# EAGLE design jarvis-2.0 (EAGLE 6.6.0)
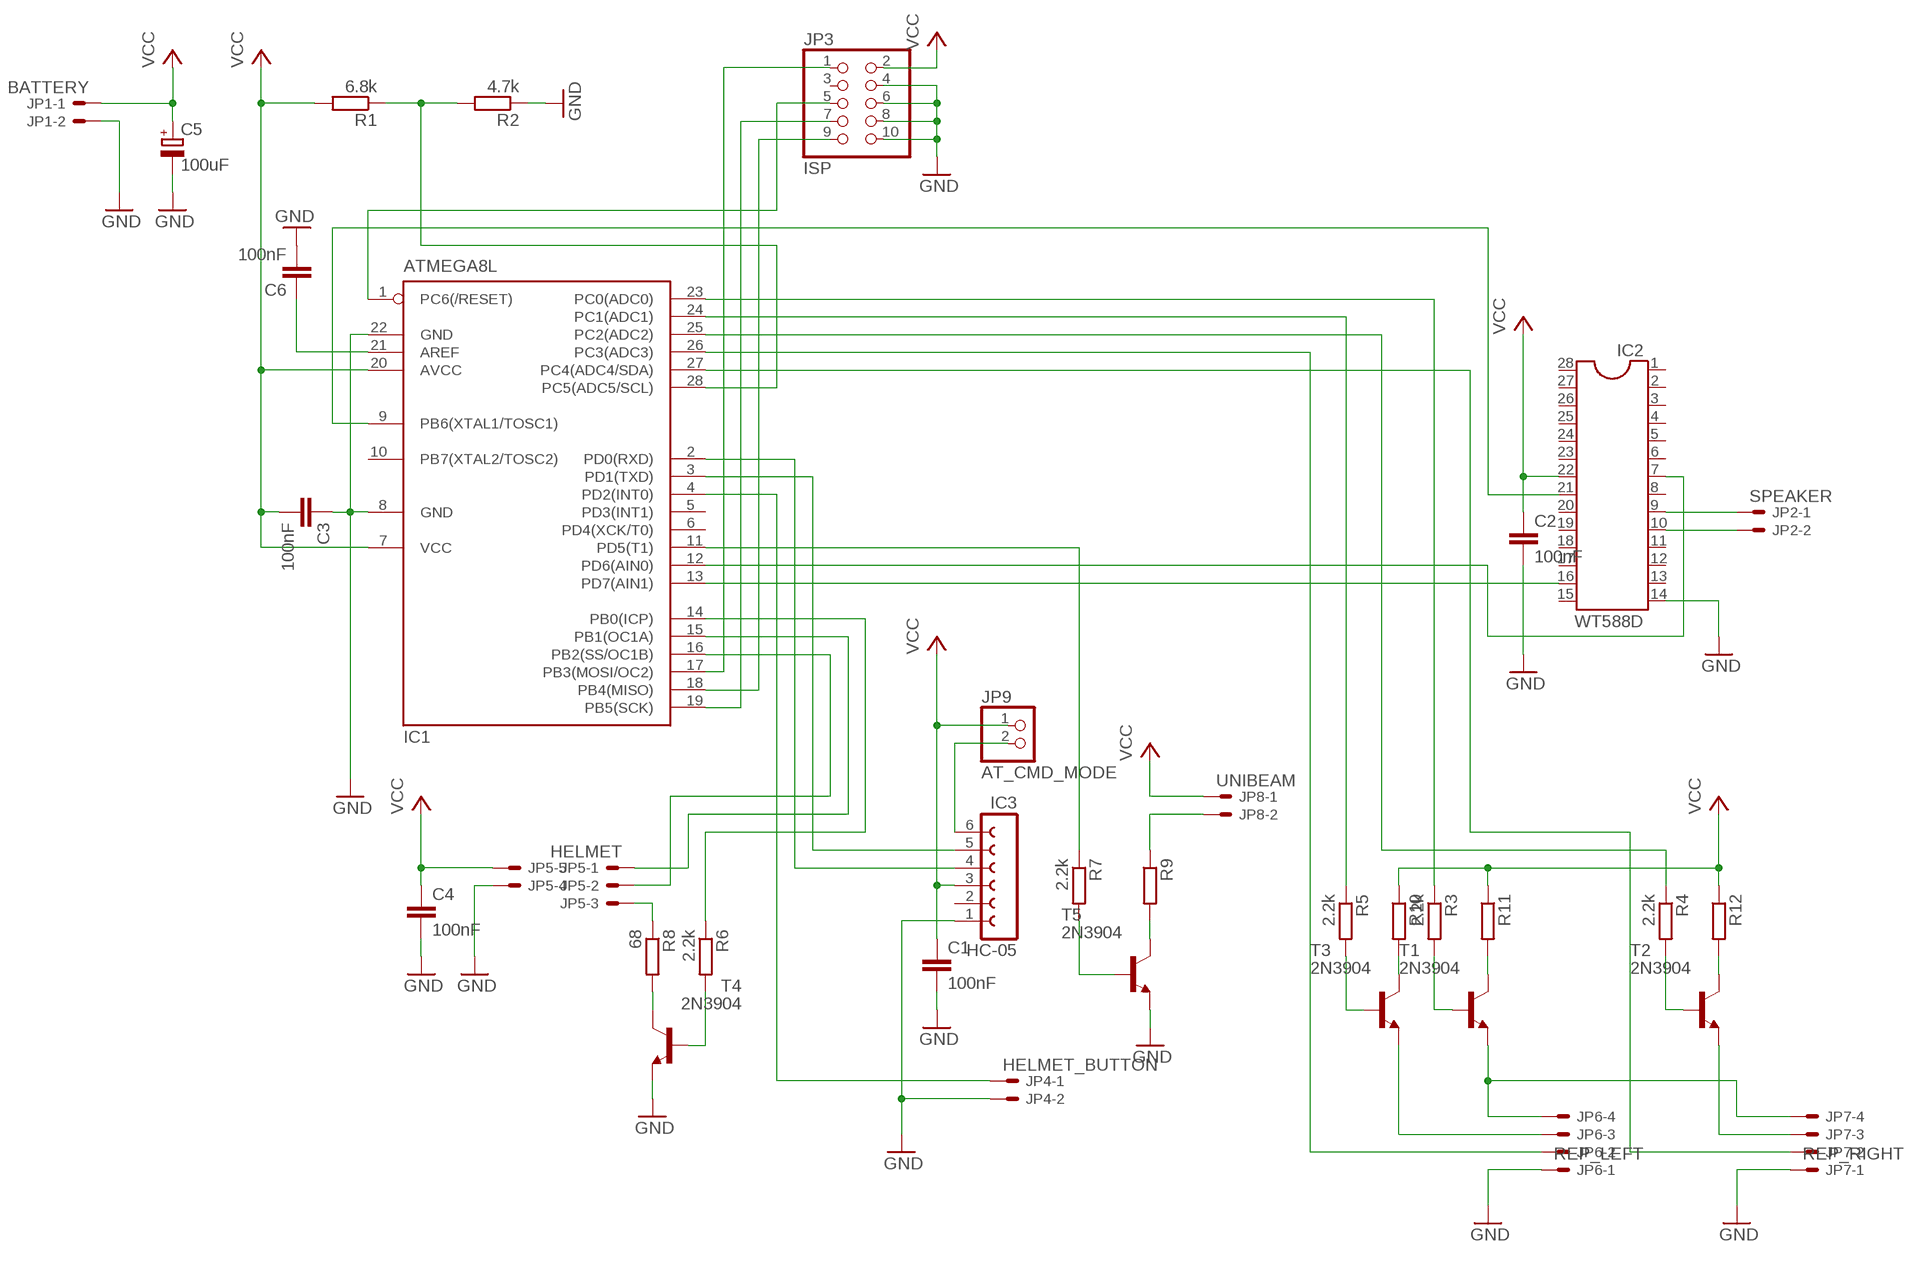
[diagram p0: schematic, sheet 1]

## Parts
C1  100nF  C2.5/2  [C2.5-2]
C2  100nF  C2.5/2  [C2.5-2]
C3  100nF  C2.5/2  [C2.5-2]
C4  100nF  C2.5/2  [C2.5-2]
C5  100uF  CPOL-EUE5-5  [E5-5]
C6  100nF  C2.5/2  [C2.5-2]
IC1  ATMEGA8L  MEGA8-P  [DIL28-3]
IC2  WT588D  DIL28  [DIL28-6]
IC3  HC-05  FE06-1  [FE06]
JP1  BATTERY  22-23-2021  [22-23-2021]
JP2  SPEAKER  22-23-2021  [22-23-2021]
JP3  ISP  PINHD-2X5  [2X05]
JP4  HELMET_BUTTON  22-23-2021  [22-23-2021]
JP5  HELMET  22-23-2051  [22-23-2051]
JP6  REP_LEFT  22-23-2041  [22-23-2041]
JP7  REP_RIGHT  22-23-2041  [22-23-2041]
JP8  UNIBEAM  22-23-2021  [22-23-2021]
JP9  AT_CMD_MODE  PINHD-1X2  [1X02]
R1  6.8k  R-EU_0204/7  [0204/7]
R2  4.7k  R-EU_0204/7  [0204/7]
R3  2.2k  R-EU_0204/7  [0204/7]
R4  2.2k  R-EU_0204/7  [0204/7]
R5  2.2k  R-EU_0204/7  [0204/7]
R6  2.2k  R-EU_0204/7  [0204/7]
R7  2.2k  R-EU_0204/7  [0204/7]
R8  68  R-EU_0204/7  [0204/7]
R9  R-EU_0204/7  [0204/7]
R10  R-EU_0204/7  [0204/7]
R11  R-EU_0204/7  [0204/7]
R12  R-EU_0204/7  [0204/7]
T1  2N3904  BC546-NPN-TO92-CBE  [TO92-CBE]
T2  2N3904  BC546-NPN-TO92-CBE  [TO92-CBE]
T3  2N3904  BC546-NPN-TO92-CBE  [TO92-CBE]
T4  2N3904  BC546-NPN-TO92-CBE  [TO92-CBE]
T5  2N3904  BC546-NPN-TO92-CBE  [TO92-CBE]

## Nets
B$1: IC1.14(PB0(ICP)) R6.1
GND: C1.2 C2.2 C3.1 C4.2 C5.- C6.2 IC1.8(GND) IC1.22(GND) IC2.14 IC3.1 JP1.2 JP3.4 JP3.6 JP3.8 JP3.10 JP4.2 JP5.4 JP6.1 JP7.1 R2.1 T4.E T5.E
N$1: IC1.3(PD1(TXD)) IC3.5
N$2: IC1.2(PD0(RXD)) IC3.4
N$3: IC1.4(PD2(INT0)) JP4.1
N$4: IC1.28(PC5(ADC5/SCL)) R1.1 R2.2
N$5: IC2.9 JP2.1
N$6: IC2.10 JP2.2
N$7: IC1.13(PD7(AIN1)) IC2.16
N$8: IC1.9(PB6(XTAL1/TOSC1)) IC2.21
N$9: IC1.17(PB3(MOSI/OC2)) JP3.1
N$10: IC1.18(PB4(MISO)) JP3.9
N$11: IC1.19(PB5(SCK)) JP3.7
N$12: IC1.16(PB2(SS/OC1B)) JP5.2
N$13: IC1.15(PB1(OC1A)) JP5.1
N$14: IC1.11(PD5(T1)) R7.1
N$15: IC1.23(PC0(ADC0)) R3.1
N$16: R6.2 T4.B
N$17: JP8.2 R9.1
N$18: R3.2 T1.B
N$19: R7.2 T5.B
N$20: R4.2 T2.B
N$21: IC1.12(PD6(AIN0)) IC2.7
N$22: IC1.24(PC1(ADC1)) R5.1
N$23: R5.2 T3.B
N$24: IC1.25(PC2(ADC2)) R4.1
N$25: JP6.4 JP7.4 T1.E
N$26: JP6.3 T3.E
N$27: JP7.3 T2.E
N$28: IC1.26(PC3(ADC3)) JP6.2
N$29: IC1.27(PC4(ADC4/SDA)) JP7.2
N$30: JP5.3 R8.1
N$31: R8.2 T4.C
N$32: R9.2 T5.C
N$33: R12.2 T2.C
N$34: R11.2 T1.C
N$35: R10.2 T3.C
N$37: C6.1 IC1.21(AREF)
N$38: IC3.6 JP9.2
N$40: IC1.1(PC6(/RESET)) JP3.5
VCC: C1.1 C2.1 C3.2 C4.1 C5.+ IC1.7(VCC) IC1.20(AVCC) IC2.22 IC3.3 JP1.1 JP3.2 JP5.5 JP8.1 JP9.1 R1.2 R10.1 R11.1 R12.1
Unconnected: IC1.5(PD3(INT1)) IC1.6(PD4(XCK/T0)) IC1.10(PB7(XTAL2/TOSC2)) IC2.1 IC2.2 IC2.3 IC2.4 IC2.5 IC2.6 IC2.8 IC2.11 IC2.12 IC2.13 IC2.15 IC2.17 IC2.18 IC2.19 IC2.20 IC2.23 IC2.24 IC2.25 IC2.26 IC2.27 IC2.28 IC3.2 JP3.3

## Library data of the parts
C1-C4 C6 = capacitor-wima:C: CAPACITOR naming: grid - package width
C5 = rcl:CPOL-EU: POLARIZED CAPACITOR, European symbol
IC1 = atmel:MEGA8-P: MICROCONTROLLER 8 Kbytes FLASH, 1 kbytes SRAM, 512 bytes EEPROM, USART, 4-channel 10 bit ADC, 2-channel 8 bit ADC Pin compatible with Atmega48, ATMega88, ATMega168 Source: avr.lbr; OC_FARNELL: unknown; OC_NEWARK: unknown
IC2 = ic-package:DIL28: Dual In Line
IC3 = con-lsta:FE06-1: FEMALE HEADER; OC_FARNELL: unknown; OC_NEWARK: unknown
JP1 JP2 JP4 JP8 = con-molex:22-23-2021: .100" (2.54mm) Center Header - 2 Pin; MF: MOLEX; MPN: 22-23-2021; OC_FARNELL: 1462926; OC_NEWARK: 25C3832
JP3 = pinhead:PINHD-2X5: PIN HEADER
JP5 = con-molex:22-23-2051: .100" (2.54mm) Center Header - 5 Pin; MF: MOLEX; MPN: 22-23-2051; OC_FARNELL: 1462952; OC_NEWARK: 38C9178
JP6 JP7 = con-molex:22-23-2041: .100" (2.54mm) Center Header - 4 Pin; MF: MOLEX; MPN: 22-23-2041; OC_FARNELL: 1462920; OC_NEWARK: 38C0355
JP9 = pinhead:PINHD-1X2: PIN HEADER
R1-R12 = resistor:R-EU_: RESISTOR, European symbol
T1-T5 = transistor:*-NPN-: NPN Transistror BF959 corrected 2008.03.06

## Board
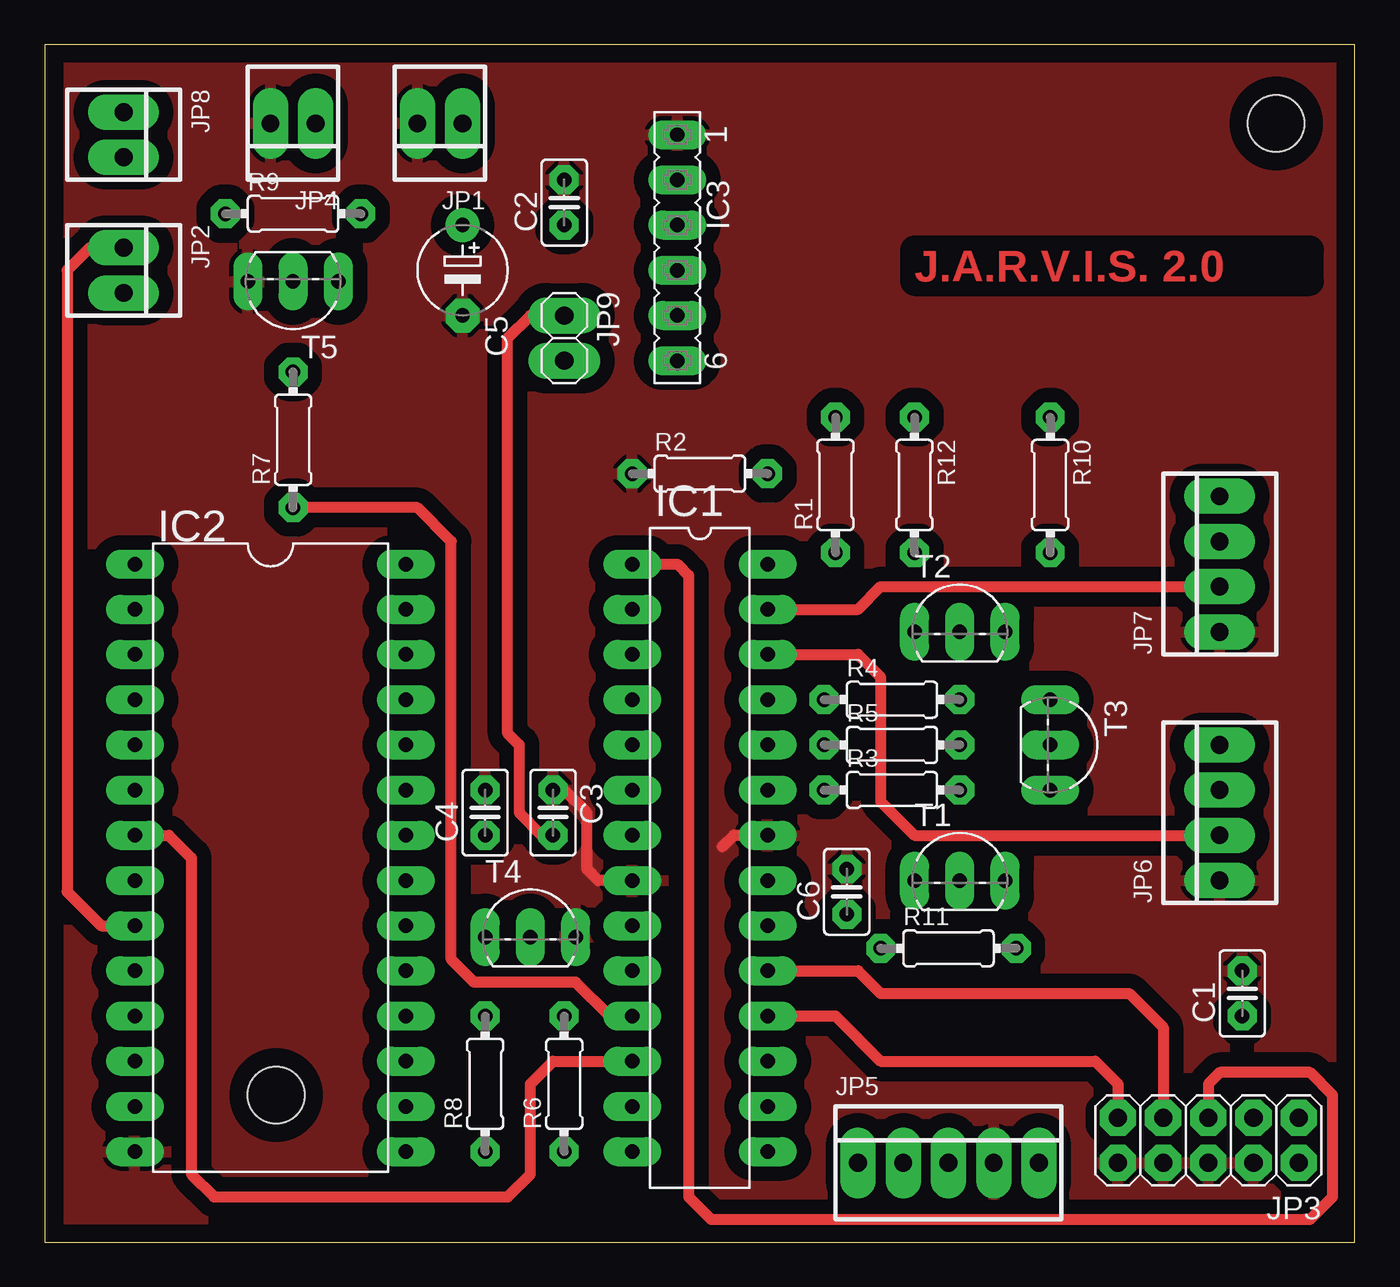
[diagram p1: board, top side]
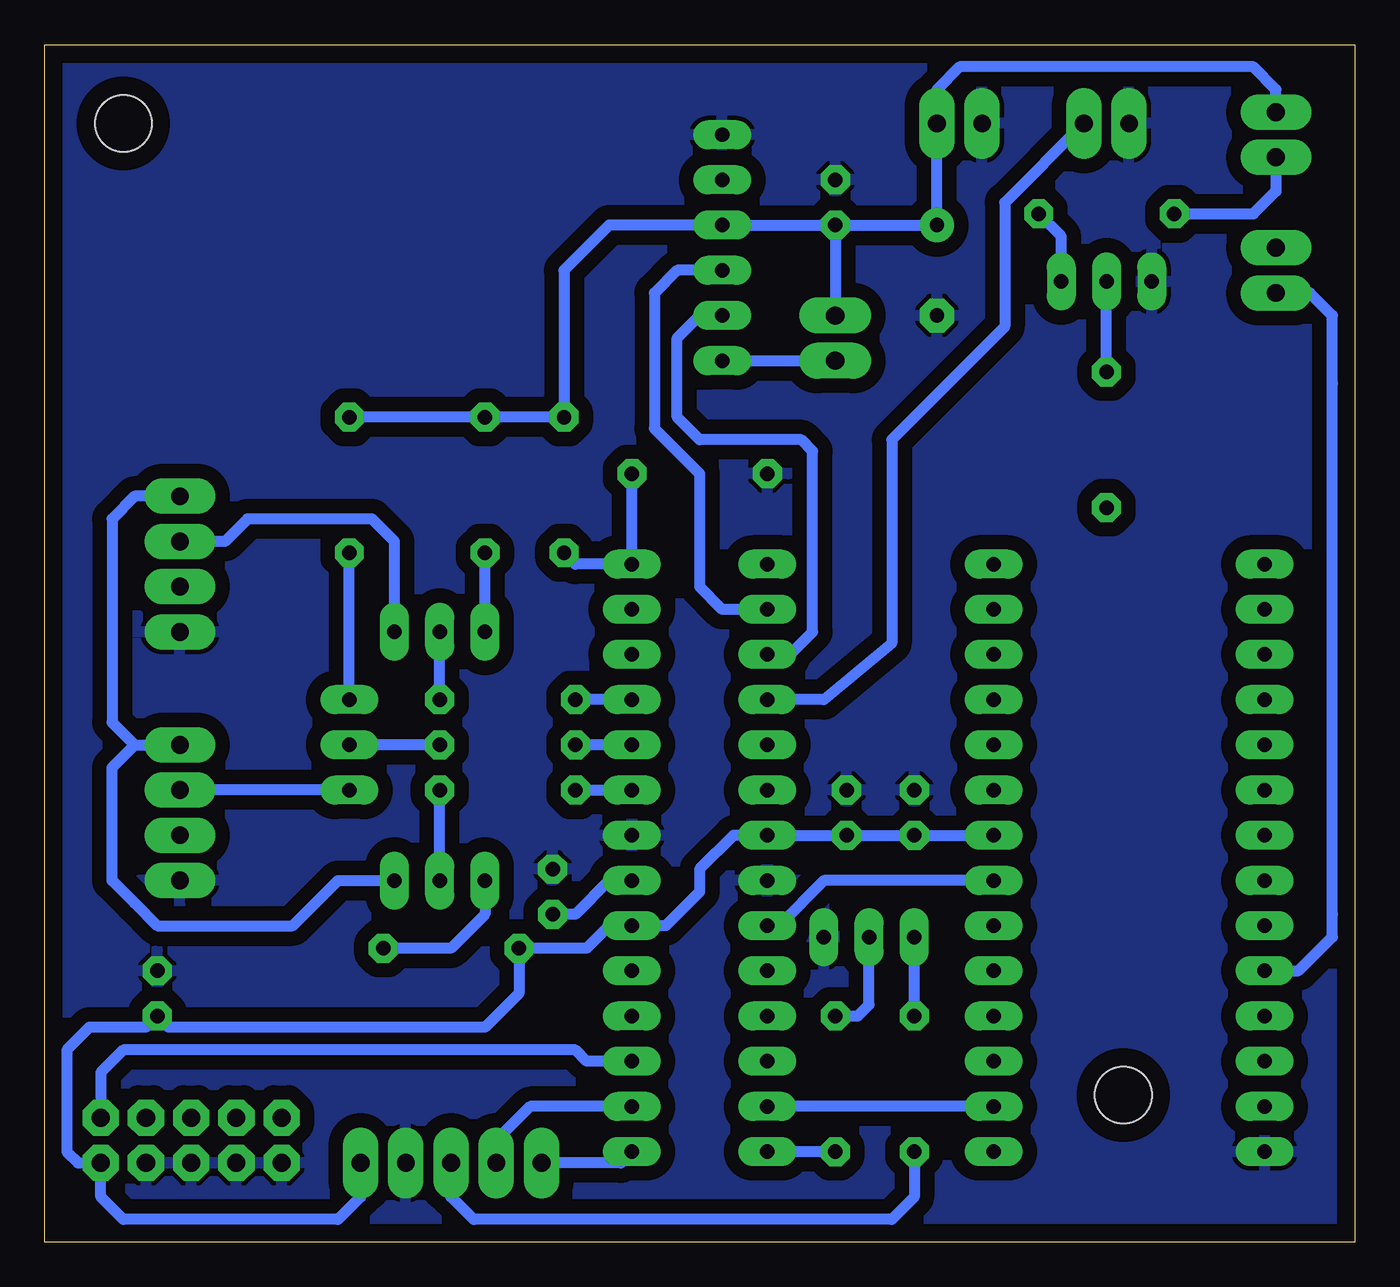
[diagram p2: board, bottom side, seen from below]

Size 73.65 x 67.3 mm. Coordinates in mm from the lower left corner, seen from the top.
Outline: 0,0 73.65,0 73.65,67.3 0,67.3 0,0
Copper layers (1*16): Top 0.035mm / dielectric 1.5mm / Bottom 0.035mm
Design rules "default *": minimum track width 10mil, minimum drill 24mil, track to track 8mil, track to pad 8mil, pad to pad 8mil, via to via 8mil, smd to smd 8mil, copper to edge 40mil, drill to drill 8mil, minimum pad ring 10mil, minimum via ring 8mil, stop-mask expansion 4mil, vias tented up to drill 0mil, thermal gap 10mil
Holes 3.2 mm at 69.22,62.87 13.02,8.26

### Footprints (pad centres in the part's own frame; a part is rotated, then mirrored left to right if it is on the bottom)
C2.5-2 = drill 0.813 pad 1.6 octagon: 1 -1.27,0; 2 1.27,0
E5-5 = drill 0.813 pad 1.905: + -2.54,0 | drill 0.813 pad 1.905 octagon: - 2.54,0
DIL28-3 = drill 0.813 long: 1 -16.51,-3.81; 2 -13.97,-3.81; 3 -11.43,-3.81; 4 -8.89,-3.81; 5 -6.35,-3.81; 6 -3.81,-3.81; 7 -1.27,-3.81; 8 1.27,-3.81; 9 3.81,-3.81; 10 6.35,-3.81; 11 8.89,-3.81; 12 11.43,-3.81; 13 13.97,-3.81; 14 16.51,-3.81; 15 16.51,3.81; 16 13.97,3.81; 17 11.43,3.81; 18 8.89,3.81; 19 6.35,3.81; 20 3.81,3.81; 21 1.27,3.81; 22 -1.27,3.81; 23 -3.81,3.81; 24 -6.35,3.81; 25 -8.89,3.81; 26 -11.43,3.81; 27 -13.97,3.81; 28 -16.51,3.81
DIL28-6 = drill 0.813 long: 1 -16.51,-7.62; 2 -13.97,-7.62; 3 -11.43,-7.62; 4 -8.89,-7.62; 5 -6.35,-7.62; 6 -3.81,-7.62; 7 -1.27,-7.62; 8 1.27,-7.62; 9 3.81,-7.62; 10 6.35,-7.62; 11 8.89,-7.62; 12 11.43,-7.62; 13 13.97,-7.62; 14 16.51,-7.62; 15 16.51,7.62; 16 13.97,7.62; 17 11.43,7.62; 18 8.89,7.62; 19 6.35,7.62; 20 3.81,7.62; 21 1.27,7.62; 22 -1.27,7.62; 23 -3.81,7.62; 24 -6.35,7.62; 25 -8.89,7.62; 26 -11.43,7.62; 27 -13.97,7.62; 28 -16.51,7.62
FE06 = drill 0.813 long: 1 -6.35,0; 2 -3.81,0; 3 -1.27,0; 4 1.27,0; 5 3.81,0; 6 6.35,0
22-23-2021 = drill 1 long: 1 -1.27,0; 2 1.27,0
2X05 = drill 1.016 octagon: 1 -5.08,-1.27; 2 -5.08,1.27; 3 -2.54,-1.27; 4 -2.54,1.27; 5 0,-1.27; 6 0,1.27; 7 2.54,-1.27; 8 2.54,1.27; 9 5.08,-1.27; 10 5.08,1.27
22-23-2051 = drill 1 long: 1 -5.08,0; 2 -2.54,0; 3 0,0; 4 2.54,0; 5 5.08,0
22-23-2041 = drill 1 long: 1 -3.81,0; 2 -1.27,0; 3 1.27,0; 4 3.81,0
1X02 = drill 1.016 long: 1 -1.27,0; 2 1.27,0
0204/7 = drill 0.813 octagon: 1 -3.81,0; 2 3.81,0
TO92-CBE = drill 0.813 long: B 0,0; C -2.54,0; E 2.54,0

### Placement (x,y rotation side)
C1  67.31,13.97 90 top
C2  29.21,58.42 90 top
C3  28.57,24.13 270 top
C4  24.77,24.13 90 top
C5  23.5,54.61 270 top
C6  45.09,19.68 90 top
IC1  36.83,21.59 270 top
IC2  12.7,21.59 270 top
IC3  35.56,55.88 270 top
JP1  22.23,62.87 180 top
JP2  4.45,54.61 270 top
JP3  65.41,5.71 180 top
JP4  13.97,62.87 180 top
JP5  50.8,4.45 0 top
JP6  66.04,24.13 90 top
JP7  66.04,38.1 90 top
JP8  4.45,62.23 270 top
JP9  29.21,50.8 270 top
R1  44.45,42.55 90 top
R2  36.83,43.18 0 top
R3  47.62,25.4 0 top
R4  47.62,30.48 0 top
R5  47.62,27.94 0 top
R6  29.21,8.89 90 top
R7  13.97,45.09 90 top
R8  24.77,8.89 90 top
R9  13.97,57.78 0 top
R10  56.52,42.55 270 top
R11  50.8,16.51 0 top
R12  48.9,42.55 270 top
T1  51.44,20.32 0 top
T2  51.44,34.29 0 top
T3  56.52,27.94 270 top
T4  27.3,17.14 0 top
T5  13.97,53.98 180 top

### Tracks (layer width: path | path; a pad name or v marks a point on that pad's centre or on a via)
B$1
  Bottom 0.61: R6.1 IC1.14
GND
  Top 0.61: IC1.8 31.11,20.32 30.48,20.95 30.48,24.13 29.21,25.4 C3.1 | IC1.22 38.73,22.86 38.1,22.23
  pour Bottom (isolate 0.813): 1.27,66.67 73.03,66.67 73.03,0.64 1.27,0.64
  pour Top (isolate 0.813): 1.27,66.67 73.03,66.67 73.03,0.64 1.27,0.64
N$1
  Bottom 0.61: IC1.3 31.75,33.02 30.48,34.29 30.48,44.45 31.11,45.09 36.83,45.09 38.1,46.35 38.1,50.8 36.83,52.07 IC3.5
N$2
  Bottom 0.61: IC1.2 35.56,35.56 36.83,36.83 36.83,43.18 39.37,45.72 39.37,53.34 38.1,54.61 IC3.4
N$3
  Bottom 0.61: IC1.4 29.84,30.48 26.04,33.66 26.04,45.09 23.5,47.62 19.68,51.44 19.68,58.42 JP4.1
N$4
  Bottom 0.61: R2.2 IC1.28 43.81,38.1 R1.1
N$5
  Top 0.61: JP2.1 2.54,55.88 1.27,54.61 1.27,19.68 3.17,17.78 IC2.9
N$6
  Bottom 0.61: IC2.10 3.17,15.24 1.27,17.14 1.27,18.41 1.27,48.26 1.27,52.07 2.54,53.34 JP2.2
N$7
  Bottom 0.61: IC2.16 IC1.13
N$8
  Bottom 0.61: IC2.21 29.84,20.32 32.38,17.78 IC1.9
N$9
  Bottom 0.61: IC1.17 43.18,10.16 43.81,10.79 69.22,10.79 70.48,9.53 JP3.1
N$10
  Top 0.61: IC1.18 44.45,12.7 46.99,10.16 59.05,10.16 60.33,8.89 JP3.9
N$11
  Top 0.61: IC1.19 45.72,15.24 46.99,13.97 60.96,13.97 62.87,12.06 JP3.7
N$12
  Bottom 0.61: IC1.16 46.35,7.62 48.26,5.71 JP5.2
N$13
  Bottom 0.61: IC1.15 41.27,4.45 JP5.1
N$14
  Top 0.61: IC1.11 31.75,12.7 29.84,14.61 24.13,14.61 22.86,15.88 22.86,39.37 20.95,41.27 R7.1
N$15
  Bottom 0.61: R3.1 IC1.23
N$16
  Bottom 0.61: R6.2 27.94,12.7 27.3,13.34 T4.B
N$17
  Bottom 0.61: R9.1 5.71,57.78 4.45,59.05 JP8.2
N$18
  Bottom 0.61: T1.B R3.2
N$19
  Bottom 0.61: R7.2 T5.B
N$20
  Bottom 0.61: R4.2 T2.B
N$21
  Top 0.61: IC2.7 6.99,22.86 8.26,21.59 8.26,3.81 9.53,2.54 26.04,2.54 27.3,3.81 27.3,8.89 28.57,10.16 IC1.12
N$22
  Bottom 0.61: IC1.24 R5.1
N$23
  Bottom 0.61: R5.2 T3.B
N$24
  Bottom 0.61: IC1.25 R4.1
N$25
  Bottom 0.61: 67.31,27.94 67.63,27.62 67.63,27.94 | T1.E 57.15,20.32 59.69,17.78 67.31,17.78 68.58,19.05 69.85,20.32 69.85,26.67 68.58,27.94 | JP6.4 67.63,27.94 | JP7.4 68.58,41.91 69.85,40.64 69.85,29.21 68.58,27.94 | 68.58,27.94 67.63,27.94
N$26
  Bottom 0.61: T3.E JP6.3
N$27
  Bottom 0.61: T2.E 53.98,39.37 55.24,40.64 62.23,40.64 63.5,39.37 JP7.3
N$28
  Top 0.61: IC1.26 45.72,33.02 46.99,31.75 46.99,24.77 48.9,22.86 JP6.2
N$29
  Top 0.61: IC1.27 45.72,35.56 46.99,36.83 JP7.2
N$30
  Bottom 0.61: R8.1 24.77,2.54 26.04,1.27 49.53,1.27 50.8,2.54 JP5.3
N$31
  Bottom 0.61: R8.2 T4.C
N$32
  Bottom 0.61: T5.C 16.51,56.52 R9.2
N$33
  Bottom 0.61: T2.C R12.2
N$34
  Bottom 0.61: T1.C 48.9,18.41 50.8,16.51 R11.2
N$35
  Bottom 0.61: T3.C R10.2
N$37
  Bottom 0.61: IC1.21 41.91,20.32 43.81,18.41 C6.1
N$38
  Bottom 0.61: IC3.6 JP9.2
N$40
  Top 0.61: JP3.5 65.41,8.89 66.04,9.53 71.12,9.53 72.39,8.26 72.39,2.54 71.12,1.27 37.47,1.27 36.2,2.54 36.2,37.47 35.56,38.1 IC1.1
VCC
  Top 0.61: C3.2 27.94,22.86 26.67,24.13 26.67,27.94 26.04,28.57 26.04,50.8 27.3,52.07 JP9.1
  Bottom 0.61: C2.1 IC3.3 41.91,57.15 44.45,54.61 R1.2 R12.1 R10.1 | C2.1 JP9.1 | IC2.22 C4.1 C3.2 IC1.7 34.92,22.86 36.83,20.95 36.83,19.68 38.73,17.78 IC1.20 41.91,17.78 43.18,16.51 R11.1 46.99,13.97 48.9,12.06 66.67,12.06 C1.1 67.94,12.06 71.12,12.06 72.39,10.79 72.39,5.08 71.75,4.45 JP3.2 70.48,2.54 69.22,1.27 57.15,1.27 55.88,2.54 JP5.5 | C2.1 C5.+ JP1.1 23.5,64.77 22.23,66.04 5.71,66.04 4.45,64.77 JP8.1

### Text on the board
Top: J.A.R.V.I.S. 2.0